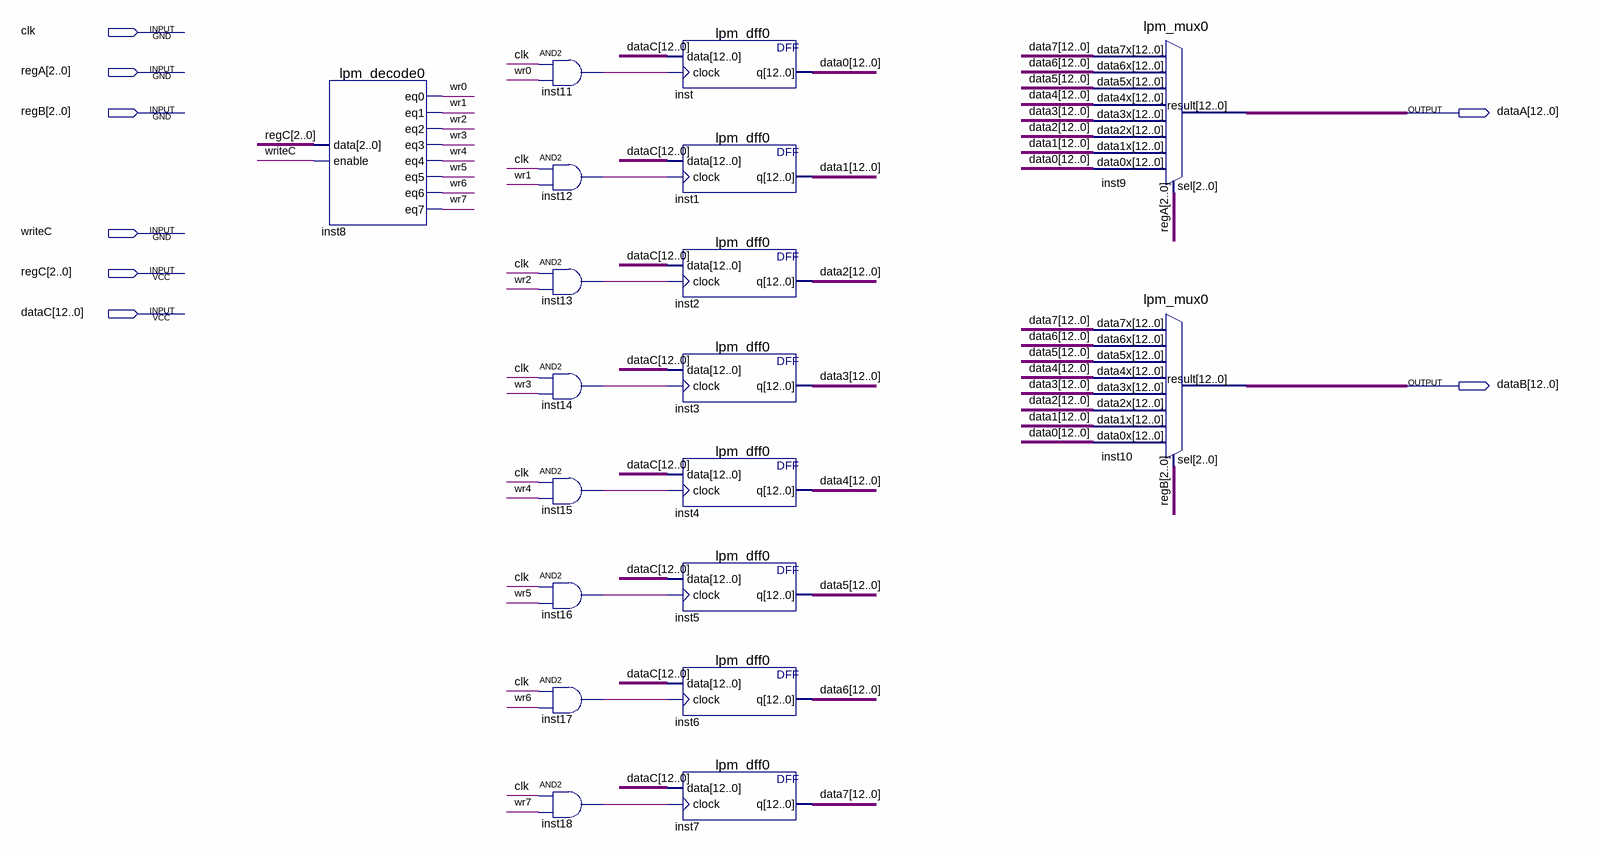
[diagram p0: schematic sheet]
// Quartus schematic reg.bdf as structural Verilog: 19 symbols, 8 pins
module \reg  (
  input  clk,
  input  [2:0] regA,
  input  [2:0] regB,
  input  writeC,
  input  [2:0] regC,
  input  [12:0] dataC,
  output [12:0] dataA,
  output [12:0] dataB
);

  wire inst11_out, inst12_out, inst13_out, inst14_out, inst15_out, inst16_out, inst17_out, inst18_out, wr0,
       wr1, wr2, wr3, wr4, wr5, wr6, wr7;
  wire [12:0] data0, data1, data2, data3, data4, data5, data6, data7;

  lpm_decode0 inst8 (
    .data(regC), .enable(writeC), .eq0(wr0), .eq1(wr1), .eq2(wr2), .eq3(wr3), .eq4(wr4), .eq5(wr5),
    .eq6(wr6), .eq7(wr7));
  and inst11 (inst11_out, clk, wr0);
  and inst12 (inst12_out, clk, wr1);
  and inst13 (inst13_out, clk, wr2);
  and inst14 (inst14_out, clk, wr3);
  and inst15 (inst15_out, clk, wr4);
  and inst16 (inst16_out, clk, wr5);
  and inst17 (inst17_out, clk, wr6);
  and inst18 (inst18_out, clk, wr7);
  lpm_dff0 inst (.data(dataC), .clock(inst11_out), .q(data0));
  lpm_dff0 inst1 (.data(dataC), .clock(inst12_out), .q(data1));
  lpm_dff0 inst2 (.data(dataC), .clock(inst13_out), .q(data2));
  lpm_dff0 inst3 (.data(dataC), .clock(inst14_out), .q(data3));
  lpm_dff0 inst4 (.data(dataC), .clock(inst15_out), .q(data4));
  lpm_dff0 inst5 (.data(dataC), .clock(inst16_out), .q(data5));
  lpm_dff0 inst6 (.data(dataC), .clock(inst17_out), .q(data6));
  lpm_dff0 inst7 (.data(dataC), .clock(inst18_out), .q(data7));
  lpm_mux0 inst9 (
    .data7x(data7), .data6x(data6), .data5x(data5), .data4x(data4), .data3x(data3), .data2x(data2),
    .data1x(data1), .data0x(data0), .sel(regA), .result(dataA));
  lpm_mux0 inst10 (
    .data7x(data7), .data6x(data6), .data5x(data5), .data4x(data4), .data3x(data3), .data2x(data2),
    .data1x(data1), .data0x(data0), .sel(regB), .result(dataB));
endmodule
